# EasyEDA Pro project 【平衡车】STM32F103C8T6 .epro

# Schematic Schematic1
Create Date: 2022-09-10; Page Name: 【平衡车】STM32F103VCT6; Project Name: 【平衡车】STM32F103VCT6; Schematic Name: Schematic1; Update Date: 2023-07-14; Company: 嘉立创EDA
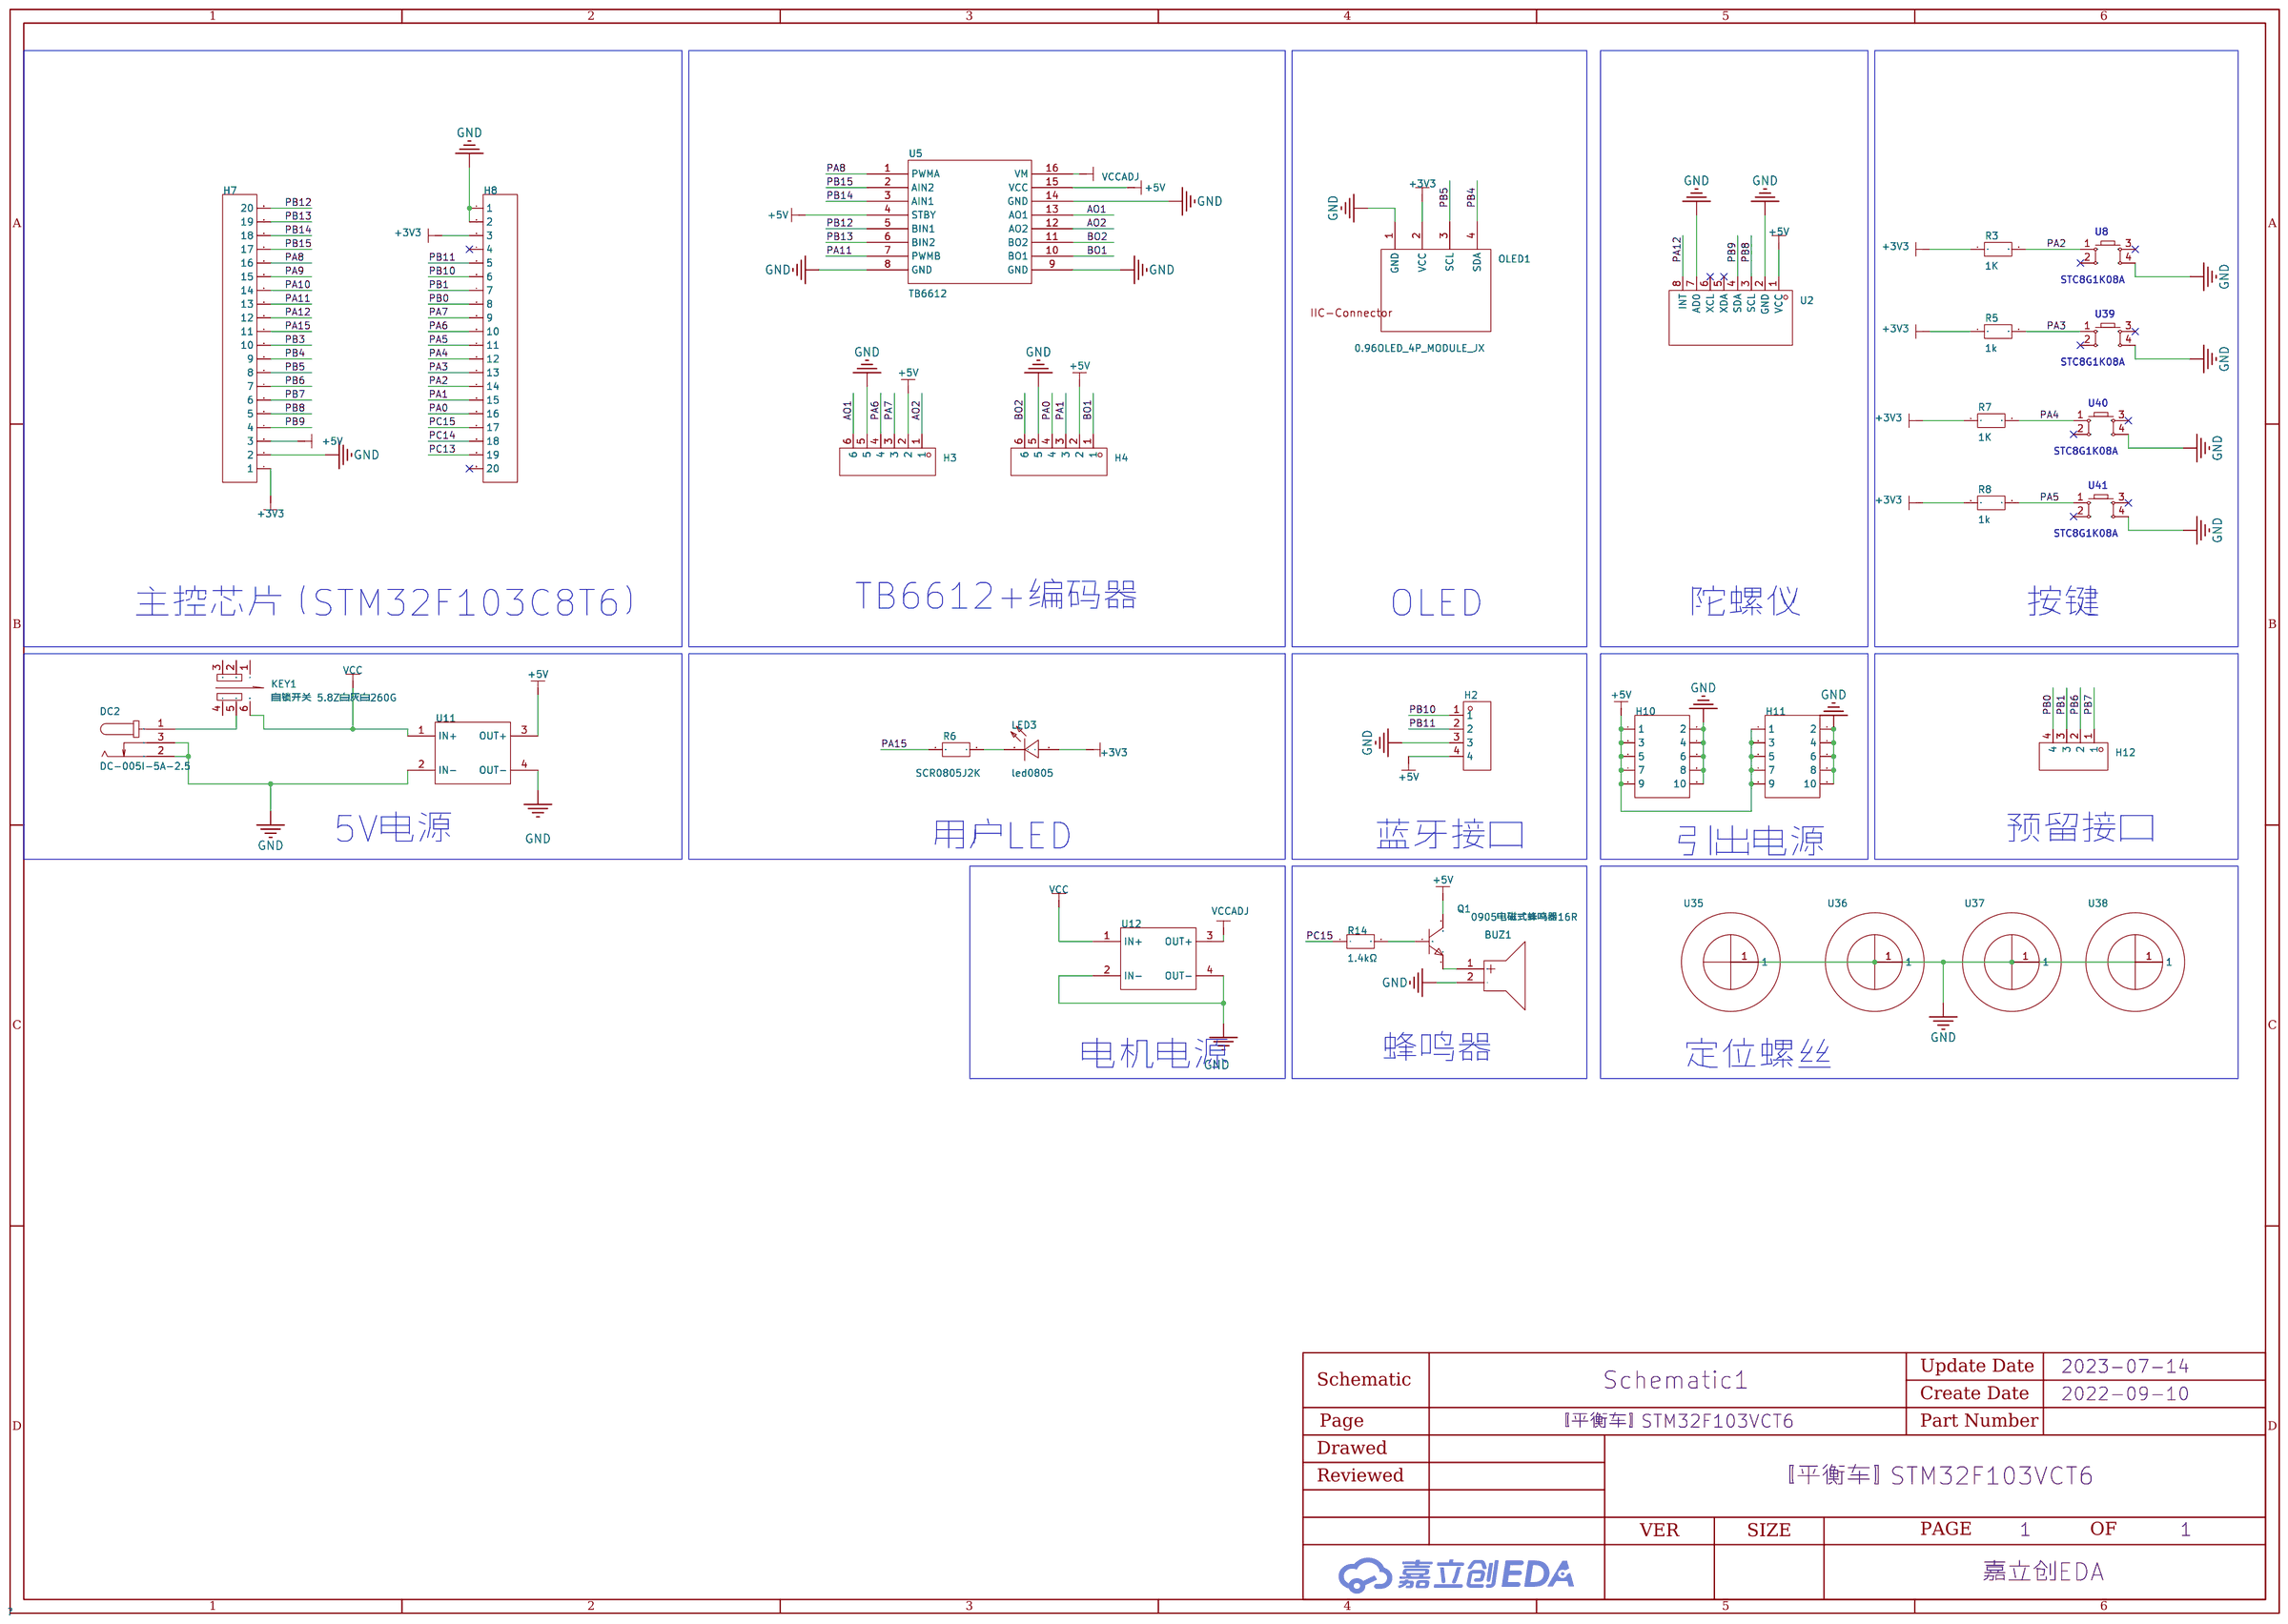
[diagram p0: schematic sheet]

## Parts
BUZ1  0905电磁式蜂鸣器16R  [BUZ-TH_BD9.0-P4.00-D0.6-FD]
DC2  DC-005I-5A-2.5  [DC-IN-TH_DC-005I-5A-2.5]
H2  -  [HDR-TH_4P-P2.54-V-F]
H3  -  [HDR-TH_6P-P2.54-V-F]
H4  -  [HDR-TH_6P-P2.54-V-F]
H7  -  [HDR-TH_20P-P2.54-V-F]
H8  -  [HDR-TH_20P-P2.54-V-F]
H10  -  [HDR-TH_10P-P2.54-V-F-R2-C5-S2.54]
H11  -  [HDR-TH_10P-P2.54-V-F-R2-C5-S2.54]
H12  -  [HDR-TH_4P-P2.54-V-F]
KEY1  自锁开关 5.8Z白灰白260G  [SW-TH_6P-L5.8-W5.8-P2.00-LS4.5-TR]
LED3  led0805  [LED0805-RD]
OLED1  0.96OLED_4P_MODULE_JX  [0.96OLED_4P]
Q1  -  [S8050_TO_92]
R3  1K  [R0805]
R5  1k  [R0805]
R6  SCR0805J2K  [R0805]
R7  1K  [R0805]
R8  1k  [R0805]
R14  1.4kΩ  [R0603]
U2  -  [MPU6050]
U5  TB6612  [TB6612]
U8  STC8G1K08A  [SW-TH_4P-L6.0-W6.0-P4.50-LS6.5]
U11  -  [LM2596模块]
U12  -  [LM2596模块]
U35  -  [M3_花孔]
U36  -  [M3_花孔]
U37  -  [M3_花孔]
U38  -  [M3_花孔]
U39  STC8G1K08A  [SW-TH_4P-L6.0-W6.0-P4.50-LS6.5]
U40  STC8G1K08A  [SW-TH_4P-L6.0-W6.0-P4.50-LS6.5]
U41  STC8G1K08A  [SW-TH_4P-L6.0-W6.0-P4.50-LS6.5]

## Library data of the parts
BUZ1 = 0905电磁式蜂鸣器16R: Supplier Part: C9900018545; Supplier Footprint: TH-2P; JLCPCB Part Class: 扩展库; Datasheet: https://atta.szlcsc.comnull; Supplier: LCSC
DC2 = DC-005I-5A-2.5: 连接器类型:DC电源插座;安装方式:弯插;触点内径:2.5mm;触点外径:5.85mm;额定电流:5A;额定电压:24V;触头材质:黄铜;工作温度范围:-20℃~+70℃;焊接温度(最大值):260℃;; LCSC Part Name: DC电源插座 内径:2.5mm 外径:5.85mm; Supplier Part: C2689704; Manufacturer: XKB Connectivity(中国星坤); Supplier Footprint: 插件; JLCPCB Part Class: 扩展库; Datasheet: https://atta.szlcsc.com/upload/public/pdf/source/20211011/5C01D7786A273E00B362418B0553C5C6.pdf; Supplier: LCSC; Connector Type: DC电源插座; Mounting Style: 弯插; Inside Contact Diameter: 2.5mm; Outside Contact Diameter: 5.85mm; Current Rating (Max): 5A; Voltage Rating (Max): 24V; Contact Material: 黄铜; Operating Temperature Range: -20℃~+70℃; Welding Temperature (Max): 260℃
H2 H12 = HDR-F_2.54_1x4P: Supplier Part: C2718488; Supplier Footprint: 插件
H3 H4 = HDR-F_2.54_1x6P: Supplier Part: C40877; Supplier Footprint: 插件
H7 H8 = HDR-F_2.54_1x20P: Supplier Part: C50984; Supplier Footprint: 插件
H10 H11 = HDR-F_2.54_2x5: Supplier Part: C92270; Supplier Footprint: 插件
KEY1 = 自锁开关 5.8Z白灰白260G: 耐温260度; LCSC Part Name: 自锁开关 5.8Z白灰白 260G  5.8*5.8mm; Supplier Part: C56857; Supplier Footprint: Through Hole; JLCPCB Part Class: 扩展库; Datasheet: https://atta.szlcsc.com/upload/public/pdf/source/20160318/1458266987096.pdf; Supplier: LCSC
LED3 = led0805: Supplier Part: C9900012722; JLCPCB Part Class: 扩展库; Datasheet: https://atta.szlcsc.comnull; Supplier: LCSC
OLED1 = 0.96OLED_4P_MODULE_JX: Supplier Part: C9900004566; Supplier Footprint: THrough hole; JLCPCB Part Class: 扩展库; Datasheet: https://atta.szlcsc.comnull; Supplier: LCSC
Q1 = S8050_TO_NPN: Supplier Footprint: TO-92
R3 R5-R8 = SCR0805J2K: LCSC Part Name: ±5% 2K; Supplier Part: C3017846; Manufacturer: VO(翔胜); Supplier Footprint: 0805; Datasheet: https://atta.szlcsc.com/upload/public/pdf/source/20220513/247AF9639BA21CF93567DC289CCC6A22.pdf; Supplier: LCSC
R14 = CRCW06031K40FKEA: 电阻类型:厚膜电阻;阻值:1.4kΩ;精度:±1%;功率:100mW;; LCSC Part Name: 1.4kΩ ±1% 100mW; Supplier Part: C844138; Manufacturer: VISHAY(威世); Supplier Footprint: 0603; JLCPCB Part Class: 扩展库; Datasheet: https://atta.szlcsc.com/upload/public/pdf/source/20200922/C242478_0C7172CD6F5C3D507069694ED76193BB.pdf; Supplier: LCSC; Type: 厚膜电阻; Tolerance: ±1%; Power(Watts): 100mW; Temperature Coefficient: ±100ppm/℃; Overload Voltage (Max): 75V; Operating Temperature Range: -55℃~+155℃
U2 = MPU6050: _: 3
U5 = TB6612
U8 U39-U41 = 轻触按键直插: Supplier Part: C9900022465; Supplier Footprint: SOP-8; JLCPCB Part Class: 扩展库; Datasheet: https://atta.szlcsc.comnull; Supplier: LCSC
U11 U12 = LM2596模块
U35-U38 = M3孔_花孔: Check: false

## Nets
+3V3: H7.1 H8.3 LED3.2(+) OLED1.2(VCC) R3.1 R5.1 R7.1 R8.1
+5V: H2.4 H3.2 H4.2 H7.3 H10.1 H10.3 H10.5 H10.7 H10.9 H11.1 H11.3 H11.5 H11.7 H11.9 Q1.3(C) U2.1(VCC) U5.4(STBY) U5.15(VCC) U11.3(OUT+)
GND: BUZ1.2(-) DC2.2 DC2.3 H2.3 H3.5 H4.5 H7.2 H8.1 H8.2 H10.2 H10.4 H10.6 H10.8 H10.10 H11.2 H11.4 H11.6 H11.8 H11.10 OLED1.1(GND) U2.2(GND) U2.7(AD0) U5.8(GND) U5.9(GND) U5.14(GND) U8.4 U11.2(IN-) U11.4(OUT-) U12.2(IN-) U12.4(OUT-) U35.1 U36.1 U37.1 U38.1 U39.4 U40.4 U41.4
VCC: KEY1.6 U11.1(IN+) U12.1(IN+)
VCCADJ: U5.16(VM) U12.3(OUT+)
AO1: H3.6 U5.13(AO1)
AO2: H3.1 U5.12(AO2)
BO1: H4.1 U5.10(BO1)
BO2: H4.6 U5.11(BO2)
PA0: H4.4 H8.16
PA1: H4.3 H8.15
PA2: H8.14 R3.2 U8.1
PA3: H8.13 R5.2 U39.1
PA4: H8.12 R7.2 U40.1
PA5: H8.11 R8.2 U41.1
PA6: H3.4 H8.10
PA7: H3.3 H8.9
PA8: H7.16 U5.1(PWMA)
PA9: H7.15
PA10: H7.14
PA11: H7.13 U5.7(PWMB)
PA12: H7.12 U2.8(INT)
PA15: H7.11 R6.1
PB0: H8.8 H12.4
PB1: H8.7 H12.3
PB3: H7.10
PB4: H7.9 OLED1.4(SDA)
PB5: H7.8 OLED1.3(SCL)
PB6: H7.7 H12.2
PB7: H7.6 H12.1
PB8: H7.5 U2.3(SCL)
PB9: H7.4 U2.4(SDA)
PB10: H2.1 H8.6
PB11: H2.2 H8.5
PB12: H7.20 U5.5(BIN1)
PB13: H7.19 U5.6(BIN2)
PB14: H7.18 U5.3(AIN1)
PB15: H7.17 U5.2(AIN2)
PC13: H8.19
PC14: H8.18
PC15: H8.17 R14.1
$1N43883: LED3.1(-) R6.2
$1N45632: DC2.1 KEY1.5
$1N46079: Q1.2(B) R14.2
$1N46080: BUZ1.1(+) Q1.1(E)

Not connected (* = marked no-connect by the designer): H8 4* 20*; KEY1 1 2 3 4; U2 5(XDA)* 6(XCL)*; U8 2* 3*; U39 2* 3*; U40 2* 3*; U41 2* 3*

## Notes on the sheet
- TB6612+编码器
- 主控芯片（STM32F103C8T6）
- OLED
- 陀螺仪
- 按键
- 5V电源
- 用户LED
- 蓝牙接口
- 引出电源
- 预留接口
- 蜂鸣器
- 电机电源
- 定位螺丝

# Board PCB1
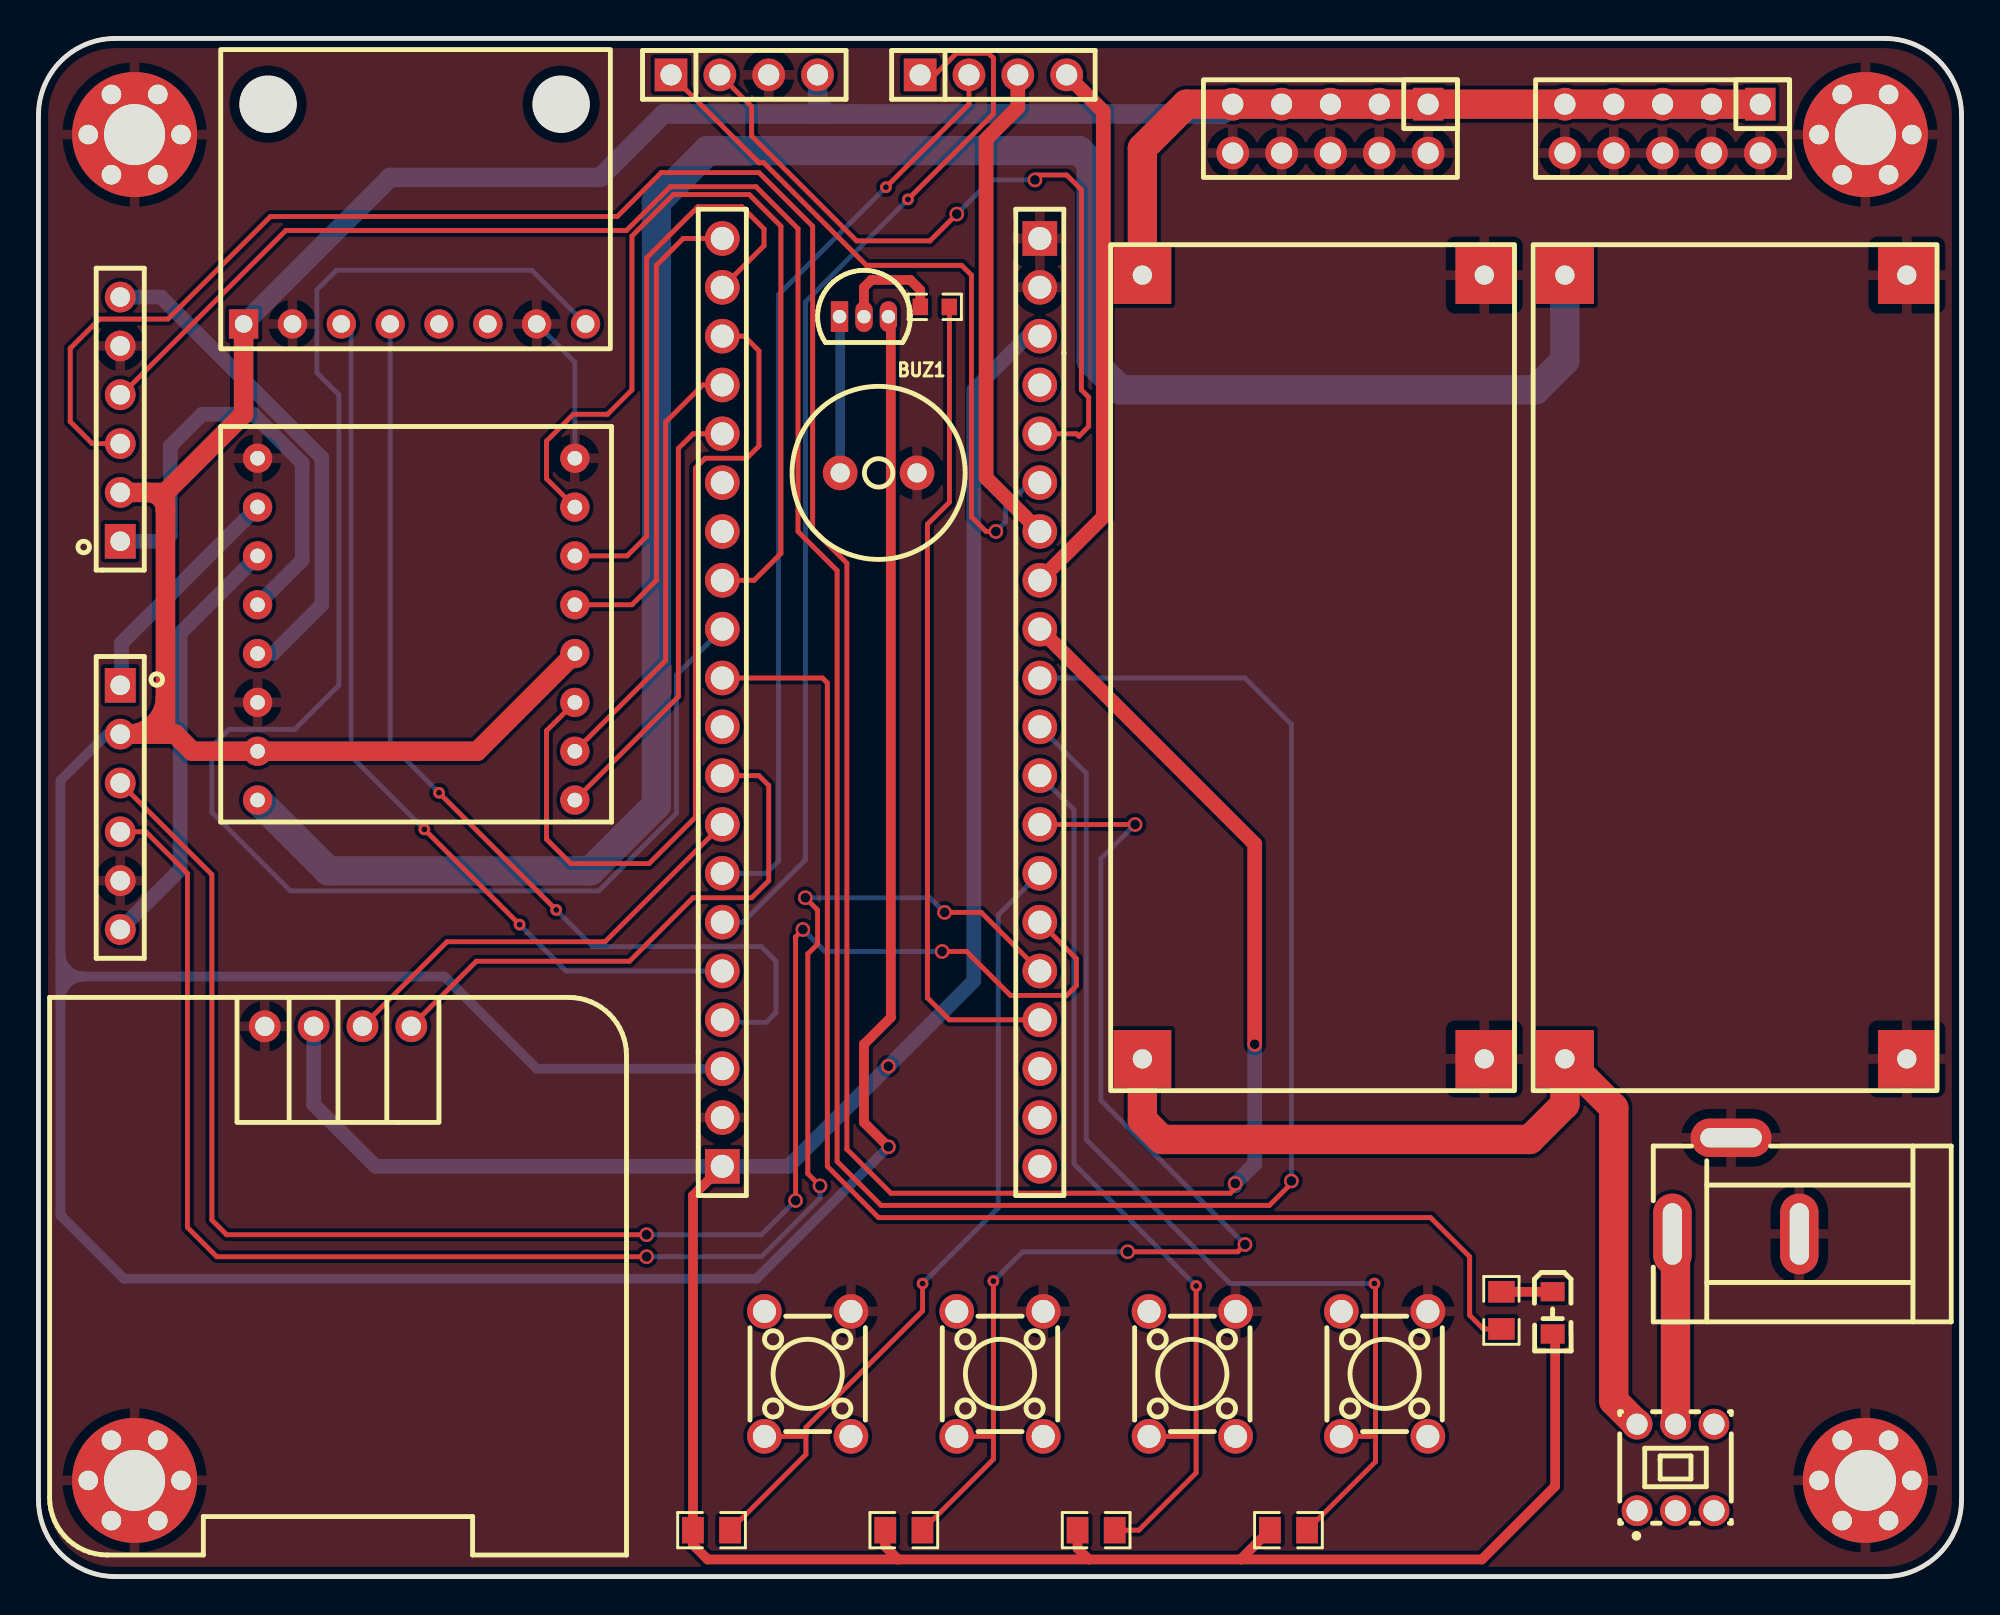
[diagram p1: board, top side]
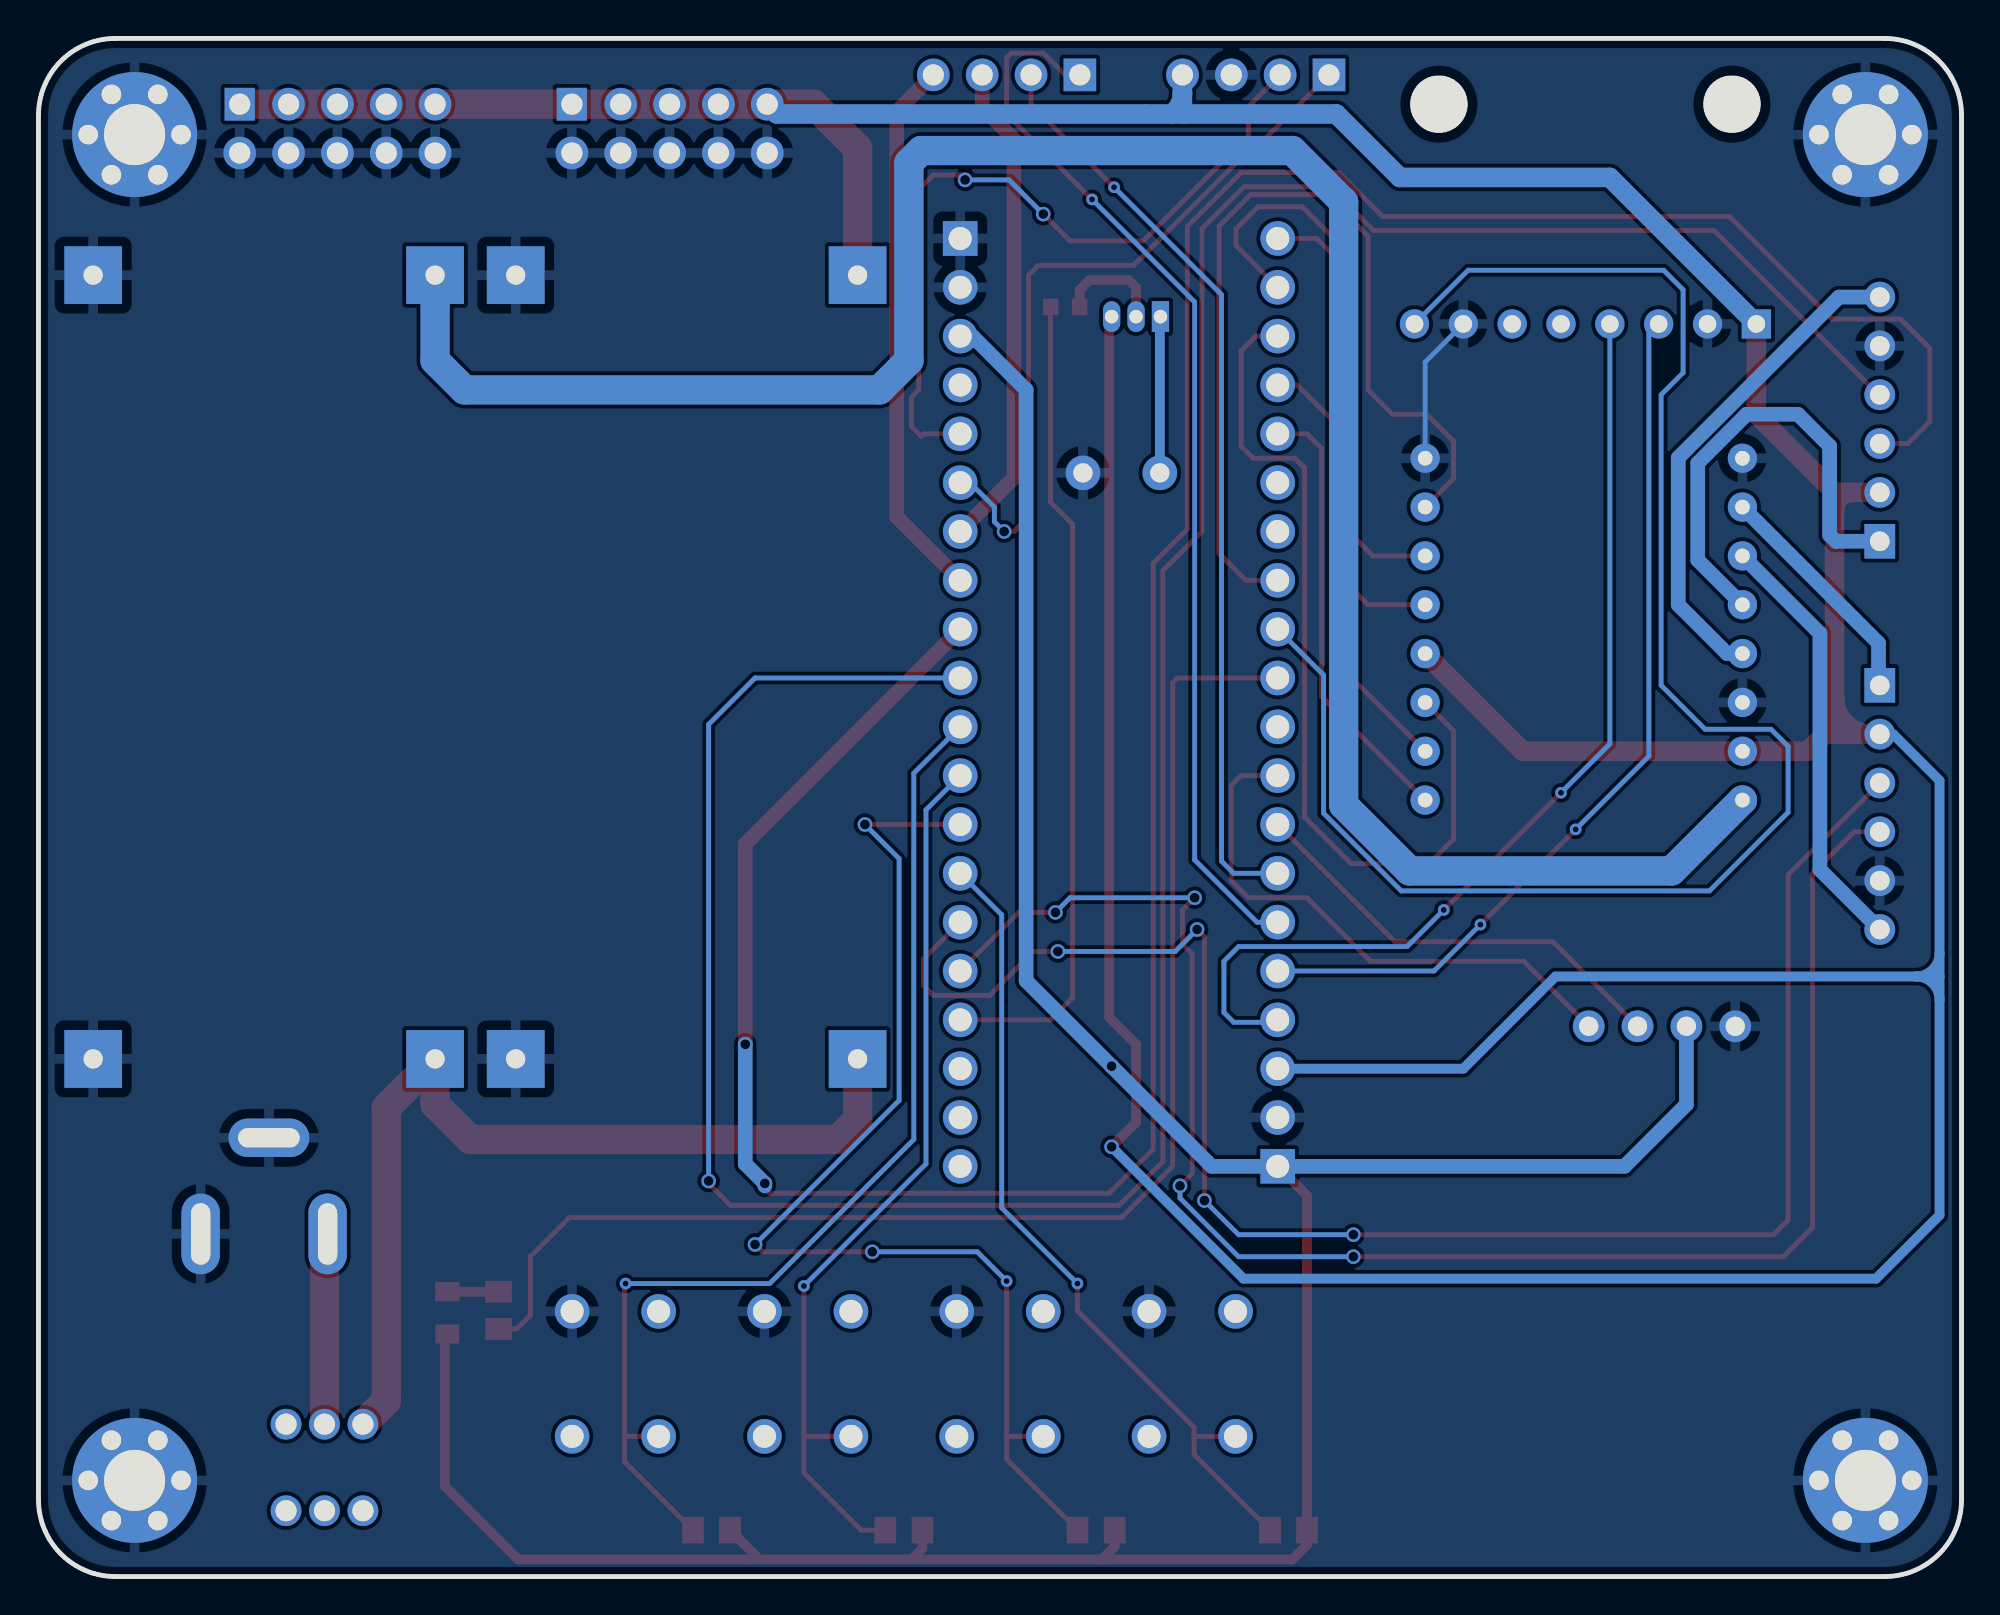
[diagram p2: board, bottom side, seen from below]

Outline 100 x 80 mm; copper layers: Top Layer, Bottom Layer. Coordinates in mm from the lower left corner of the outline.
Outline path: 0,76 0,4 arc(1.17,1.17) 4,0 96,0 arc(98.83,1.17) 100,4 100,76 arc(98.83,78.83) 96,80 4,80 arc(1.17,78.83) 0,76
Stack: Top Layer 0.035mm / Dielectric1 1.51mm FR4 er 4.5 / Bottom Layer 0.035mm

## Design rules (mm)
spacing safeClearance (default): track to track 0.152, other pairs 0.152 to 0.3
track width trackWidth (default): min 0.127, default 0.254, max 2.54
differential pair differentialPair (default): width min 0.127, default 0.254, max 2.54; gap min 0.152, default 0.152
via viaSize (default): diameter min 0.5, default 0.61, max 10; hole min 0.3, default 0.305, max 6

## Placement (name value [footprint] x y rotation side)
BUZ1  0905电磁式蜂鸣器16R  [BUZ-TH_BD9.0-P4.00-D0.6-FD]  43.69 57.4 0 top
DC2  DC-005I-5A-2.5  [DC-IN-TH_DC-005I-5A-2.5]  88.26 20.32 180 top
H2  -  [HDR-TH_4P-P2.54-V-F]  36.7 78.11 0 top
H3  -  [HDR-TH_6P-P2.54-V-F]  4.25 60.2 90 top
H4  -  [HDR-TH_6P-P2.54-V-F]  4.25 40 270 top
H7  -  [HDR-TH_20P-P2.54-V-F]  35.56 45.47 90 top
H8  -  [HDR-TH_20P-P2.54-V-F]  52.07 45.47 270 top
H10  -  [HDR-TH_10P-P2.54-V-F-R2-C5-S2.54]  67.18 75.31 180 top
H11  -  [HDR-TH_10P-P2.54-V-F-R2-C5-S2.54]  84.46 75.31 180 top
H12  -  [HDR-TH_4P-P2.54-V-F]  49.66 78.11 0 top
KEY1  自锁开关 5.8Z白灰白260G  [SW-TH_6P-L5.8-W5.8-P2.00-LS4.5-TR]  85.13 5.67 180 top
LED3  led0805  [LED0805-RD]  78.74 13.72 270 top
OLED1  0.96OLED_4P_MODULE_JX  [0.96OLED_4P]  15.58 28.62 0 top
Q1  -  [S8050_TO_92]  42.93 65.53 0 top
R3  1K  [R0805]  35 2.41 0 top
R5  1k  [R0805]  45 2.41 0 top
R6  SCR0805J2K  [R0805]  76.07 13.84 90 top
R7  1K  [R0805]  55 2.41 0 top
R8  1k  [R0805]  65 2.41 0 top
R14  1.4kΩ  [R0603]  46.61 66.04 180 top
U2  -  [MPU6050]  19.56 65.15 90 top
U5  -  [TB6612]  19.38 49.53 180 top
U8  STC8G1K08A  [SW-TH_4P-L6.0-W6.0-P4.50-LS6.5]  40 10.54 90 top
U11  -  [LM2596模块]  55.75 25.15 90 top
U12  -  [LM2596模块]  77.72 25.15 90 top
U35  -  [M3_花孔]  5 5 0 top
U36  -  [M3_花孔]  95 5 0 top
U37  -  [M3_花孔]  95 75 0 top
U38  -  [M3_花孔]  5 75 0 top
U39  STC8G1K08A  [SW-TH_4P-L6.0-W6.0-P4.50-LS6.5]  50 10.54 90 top
U40  STC8G1K08A  [SW-TH_4P-L6.0-W6.0-P4.50-LS6.5]  60 10.54 90 top
U41  STC8G1K08A  [SW-TH_4P-L6.0-W6.0-P4.50-LS6.5]  70 10.54 90 top

## Footprints (pads in the part's own frame, mm; a bottom-side part is the same pattern mirrored in y, then rotated)
0.96OLED_4P
  round 1.651 hole 1.001: 1(-3.81,0) 2(-1.27,0.003) 3(1.27,0.003) 4(3.81,0.003)
BUZ-TH_BD9.0-P4.00-D0.6-FD
  round 1.801 hole 1.001: 1(-1.999,0) 2(1.999,0)
DC-IN-TH_DC-005I-5A-2.5
  oval 2x4.2 hole 1x3.2: 1(3.3,2.5) 2(-3.3,2.5)
  oval 4.2x2 hole 3.2x1: 3(0.25,-2.5)
HDR-TH_4P-P2.54-V-F
  rect 1.7x1.7 hole 1.1: 1(-3.81,0)
  round 1.7 hole 1.1: 2(-1.27,0) 3(1.27,0) 4(3.81,0)
HDR-TH_6P-P2.54-V-F
  rect 1.8x1.6 hole 1.02: 1(-6.35,0)
  round 1.6 hole 1.02: 2(-3.81,0) 3(-1.27,0) 4(1.27,0) 5(3.81,0) 6(6.35,0)
HDR-TH_10P-P2.54-V-F-R2-C5-S2.54
  rect 1.575x1.7 hole 1.1: 1(-5.08,-1.27)
  round 1.7 hole 1.1: 2(-5.08,1.27) 3(-2.54,-1.27) 4(-2.54,1.27) 5(0,-1.27) 6(0,1.27) 7(2.54,-1.27) 8(2.54,1.27) 9(5.08,-1.27) 10(5.08,1.27)
HDR-TH_20P-P2.54-V-F
  rect 1.8x1.8 hole 1.2: 1(-24.13,0)
  round 1.8 hole 1.2: 2(-21.59,0) 3(-19.05,0) 4(-16.51,0) 5(-13.97,0) 6(-11.43,0) 7(-8.89,0) 8(-6.35,0) 9(-3.81,0) 10(-1.27,0) 11(1.27,0) 12(3.81,0) 13(6.35,0) 14(8.89,0) 15(11.43,0) 16(13.97,0) 17(16.51,0) 18(19.05,0) 19(21.59,0) 20(24.13,0)
LED0805-RD
  rect 1x1.25 smd: 1(-1.1,0) 2(1.1,0)
LM2596模块
  rect 3x3 hole 1: 1(1.778,-1.651) 2(1.778,-19.431) 3(42.545,-1.651) 4(42.545,-19.431)
M3_花孔
  round 1.016 hole 1.016: 1(-2.413,0) 1(-1.206,2.09) 1(-1.206,-2.09) 1(1.206,2.09) 1(1.206,-2.09) 1(2.413,0)
  round 6.5 hole 3.175: 1(0,0)
MPU6050
  rect 1.524x1.524 hole 0.914: 1(0,8.89)
  round 1.524 hole 0.914: 2(0,6.35) 3(0,3.81) 4(0,1.27) 5(0,-1.27) 6(0,-3.81) 7(0,-6.35) 8(0,-8.89)
R0603
  rect 0.806x0.864 smd: 1(-0.753,0) 2(0.753,0)
R0805
  rect 1.133x1.377 smd: 1(-0.966,0) 2(0.966,0)
S8050_TO_92
  rect 0.899x1.6 hole 0.701: 1(-1.27,0)
  oval 0.899x1.6 hole 0.701: 2(0,0) 3(1.27,0)
SW-TH_4P-L6.0-W6.0-P4.50-LS6.5
  round 1.8 hole 1.2: 1(-3.25,2.25) 2(3.25,2.25) 3(-3.25,-2.25) 4(3.25,-2.25)
SW-TH_6P-L5.8-W5.8-P2.00-LS4.5-TR
  round 1.6 hole 1.1: 1(2,2.25) 2(0,2.25) 3(-2,2.25) 4(-2,-2.25) 5(0,-2.25) 6(2,-2.25)
TB6612
  round 1.524 hole 0.762: 1(-8.509,9.144) 2(-8.509,6.604) 3(-8.509,4.064) 4(-8.509,1.524) 5(-8.509,-1.016) 6(-8.509,-3.556) 7(-8.509,-6.096) 8(-8.509,-8.636) 9(7.991,-8.636) 10(7.991,-6.096) 11(7.991,-3.556) 12(7.991,-1.016) 13(7.991,1.524) 14(7.991,4.064) 15(7.991,6.604) 16(7.991,9.144)

## Nets
As in the schematic.

Pads without a net: H8 4 20; KEY1 1 2 3 4; U2 5 6; U8 2 3; U39 2 3; U40 2 3; U41 2 3

## Via types
v1: diameter 0.762, hole 0.508, Top Layer to Bottom Layer, 19 vias
v2: diameter 0.61, hole 0.305, Top Layer to Bottom Layer, 10 vias

## Routing (per net, layer and track width the routed paths; a pad name or vN(x,y) marks a point on that pad's centre or on a via; arc(x,y) is an arc through that point)
+3V3: length 159.8
  Top Layer w0.508: 62.51,0.89 75.06,0.89 78.87,4.7 78.87,12.49 LED3.2 ; 62.51,0.89 R8.1 ; 62.51,0.89 54.61,0.89 ; 44.7,0.89 34.8,0.89 34.03,1.65 R3.1 34.04,2.41 34.04,19.81 H7.1 ; 44.7,0.89 44.03,1.56 R5.1 ; 44.7,0.89 54.61,0.89 ; 54.61,0.89 54.03,1.47 R7.1
  Bottom Layer w0.762: H8.3 51.44,64.52 48.64,61.72 48.64,30.99 v1(44.2,26.54) 38.99,21.34 H7.1 17.53,21.34 14.31,24.55 OLED1.2
+5V: length 313.7
  Top Layer w0.508: Q1.3 44.32,65.41 44.32,29.08 42.93,27.69 42.93,23.62 v1(44.2,22.35)
  Top Layer w1.016: 6.5,43.81 6.6,43.91 6.6,45.75 ; 6.5,43.81 4.67,43.81 ; 6.5,43.81 7.11,43.81 8,42.93 U5.15 22.81,42.93 U5.4 ; 4.67,43.81 H4.2 ; 4.67,43.81 arc(6.04,44.38) 6.6,45.75 ; 6.6,56.39 6.6,55.45 ; 6.6,56.39 10.67,60.45 U2.1 ; 6.6,56.39 5.67,56.39 ; 6.6,55.45 6.6,45.75 ; 6.6,55.45 arc(6.33,56.11) 5.67,56.39 ; 5.67,56.39 H3.2
  Top Layer w1.524: H11.1 H11.3 H11.5 H11.7 H11.9 H10.1 H10.5 H10.7 59.69,76.58 57.4,74.3 U11.3
  Bottom Layer w0.508: 1.14,32.44 1.14,31.21 ; 1.14,32.44 1.14,41.4 3.56,43.81 H4.2 ; 1.14,32.44 arc(1.5,31.57) 2.37,31.21 ; 1.14,31.21 2.37,31.21 ; 1.14,31.21 1.14,29.98 ; 2.37,31.21 21.11,31.21 25.91,26.42 H7.3 ; 2.37,31.21 arc(1.5,30.85) 1.14,29.98 ; 1.14,29.98 1.14,18.8 4.44,15.49 37.34,15.49 v1(44.2,22.35)
  Bottom Layer w1.016: 62.1,76.58 61.59,76.07 42.54,76.07 ; 40.4,76.07 32.51,76.07 29.21,72.77 18.29,72.77 U2.1 ; 40.4,76.07 41.04,76.07 ; 40.4,76.07 40.51,76.18 40.51,77.16 ; H2.4 40.51,77.16 ; 40.51,77.16 arc(40.62,76.64) 40.91,76.21 41.04,76.07 ; 41.04,76.07 42.42,76.07
GND: length 7.8
  Bottom Layer w0.254: U5.8 27.89,63.17 U2.7
VCC: length 49.2
  Top Layer w1.524: KEY1.6 81.91,9.14 81.91,24.38 U12.1 79.38,24.56 77.55,22.73 58.42,22.73 57.4,23.75 U11.1
VCCADJ: length 119.7
  Bottom Layer w1.524: U5.16 15.08,36.7 28.7,36.7 32.13,40.13 32.13,71.5 34.8,74.17 54.1,74.17 54.74,73.53 54.74,63.25 56.26,61.72 77.85,61.72 79.38,63.25 U12.3
AO1: length 26
  Bottom Layer w0.762: H3.6 6.37,66.55 14.73,58.19 14.73,50.55 12.19,48.01 U5.13
AO2: length 24.3
  Bottom Layer w0.762: H3.1 6.54,53.85 6.86,54.17 6.86,58.8 8.51,60.45 11.18,60.45 13.72,57.91 13.72,52.87 U5.12
BO1: length 12.2
  Bottom Layer w0.762: 4.25,46.36 4.32,46.42 4.32,48.55 U5.10
BO2: length 22.4
  Bottom Layer w0.762: U5.11 7.37,49.06 7.37,36.77 H4.6
PA0: length 87.7
  Top Layer w0.254: H4.4 5.59,38.73 7.75,36.58 7.75,18.16 9.27,16.64 v1(31.62,16.64) ; v1(39.88,35.31) 40.51,34.67 40.51,32.89 40,32.39 40,20.96 v1(40.64,20.32) ; H8.16 49.02,34.54 v1(47.12,34.54)
  Bottom Layer w0.254: v1(47.12,34.54) 46.35,35.31 v1(39.88,35.31) ; v1(31.62,16.64) 37.59,16.64 40.64,19.69 v1(40.64,20.32)
PA1: length 90.3
  Top Layer w0.254: H8.15 53.97,32.13 53.97,30.73 53.47,30.23 50.55,30.23 48.26,32.51 v1(46.99,32.51) ; v1(39.37,19.56) 39.37,33.27 v1(39.75,33.66) ; v1(31.62,17.78) 9.78,17.78 9.02,18.54 9.02,36.51 4.25,41.28
  Bottom Layer w0.254: v1(39.37,19.56) 37.59,17.78 v1(31.62,17.78) ; v1(46.99,32.51) 40.89,32.51 v1(39.75,33.66)
PA2: length 43
  Top Layer w0.254: R3.2 39.91,6.36 39.91,7.35 ; v2(45.97,15.24) 45.97,13.82 39.91,7.75 39.91,7.35 ; 39.91,7.35 39.85,7.29 U8.1
  Bottom Layer w0.254: H8.14 49.91,34.42 49.91,19.18 v2(45.97,15.24)
PA3: length 60.9
  Top Layer w0.254: v1(57.02,39.12) H8.13 ; v2(49.66,15.37) 49.66,15.37 49.66,7.35 ; v1(62.74,17.27) 62.36,16.89 v1(56.64,16.89) ; 49.66,7.35 49.6,7.29 U39.1 ; 49.66,7.35 49.66,6.1 R5.2
  Bottom Layer w0.254: v1(57.02,39.12) 55.25,37.34 55.25,24.77 v1(62.74,17.27) ; v1(56.64,16.89) 51.18,16.89 v2(49.66,15.37)
PA4: length 47.6
  Top Layer w0.254: R7.2 57.22,2.41 60.2,5.39 60.2,7.38 ; 60.2,7.38 v2(60.2,15.11) ; 60.2,7.38 60.11,7.29 U40.1
  Bottom Layer w0.254: v2(60.2,15.11) 53.85,21.46 53.85,39.88 H8.12
PA5: length 56.7
  Top Layer w0.254: v2(69.47,15.24) 69.53,15.18 69.53,7.28 ; 69.53,7.28 69.53,5.97 R8.2 ; 69.53,7.28 69.51,7.29 U41.1
  Bottom Layer w0.254: v2(69.47,15.24) 61.98,15.24 54.48,22.73 54.48,41.78 H8.11
PA6: length 153
  Top Layer w0.254: H3.4 4.32,61.47 12.86,70.01 30.57,70.01 32.85,72.29 37.31,72.29 39.5,70.1 39.5,54.36 41.53,52.32 41.53,21.59 43.81,19.3 64.01,19.3 65.15,20.45 v1(65.15,20.57)
  Bottom Layer w0.254: H8.10 62.74,46.74 65.15,44.32 v1(65.15,20.57)
PA7: length 154.6
  Top Layer w0.254: H3.3 2.79,58.93 1.65,60.07 1.65,63.88 3.17,65.41 6.73,65.41 12.06,70.74 30.1,70.74 32.38,73.03 37.47,73.03 40.26,70.23 40.26,54.48 42.04,52.7 42.04,22.22 44.32,19.94 61.98,19.94 62.36,20.32
  Top Layer w0.762: H8.9 63.25,38.1 v1(63.25,27.69)
  Bottom Layer w0.762: 62.23,20.32 v1(62.23,20.45) 63.25,21.46 v1(63.25,27.69)
PA8: length 23.1
  Top Layer w0.254: U5.1 33.27,45.77 33.27,58.67 34.04,59.44 H7.16
PA11: length 47.6
  Top Layer w0.254: U5.7 26.42,57.1 26.42,59.06 27.81,60.45 29.59,60.45 30.86,61.72 30.86,69.72 33.02,71.88 36.96,71.88 38.61,70.23 38.61,53.21 37.21,51.82 H7.13
PA12: length 86
  Bottom Layer w0.254: U2.8 25.65,67.94 15.49,67.94 14.48,66.93 14.48,62.61 15.62,61.47 15.62,46.36 13.33,44.07 9.91,44.07 9.02,43.18 9.02,39.75 13.11,35.66 29.13,35.66 33.17,39.7 33.17,46.89 H7.12
PA15: length 71.1
  Top Layer w0.254: R6.1 75.13,12.88 74.42,13.59 74.42,16.64 72.39,18.67 43.69,18.67 41.02,21.34 41.02,46.48 40.77,46.74 H7.11
PB0: length 28.4
  Top Layer w0.762: H12.4 55.37,76.2 55.37,55.12 H8.8
PB1: length 25.6
  Top Layer w0.762: H12.3 50.93,76.41 49.28,74.76 49.28,57.15 H8.7
PB4: length 29.3
  Top Layer w0.254: OLED1.4 22.77,32 30.73,32 34.04,35.31 37.08,35.31 37.97,36.19 37.97,41.15 37.47,41.66 H7.9
PB5: length 23.1
  Top Layer w0.254: OLED1.3 21.25,33.02 29.46,33.02 H7.8
PB6: length 48.2
  Top Layer w0.254: H12.2 48.39,76.58 v2(44.07,72.26)
  Bottom Layer w0.254: H7.7 37.85,36.58 38.48,37.21 38.48,66.67 v2(44.07,72.26)
PB7: length 55.8
  Top Layer w0.254: H12.1 46.61,78.11 47.74,79.23 49.4,79.23 49.66,78.98 49.66,76.07 v2(45.21,71.63)
  Bottom Layer w0.254: H7.6 36.64,34.04 39.88,37.28 39.88,66.29 v2(45.21,71.63)
PB8: length 46.6
  Top Layer w0.254: v2(25.02,33.91) v2(20.07,38.86)
  Bottom Layer w0.254: H7.5 27.43,31.5 v2(25.02,33.91) ; v2(20.07,38.86) 16.26,42.67 16.26,64.64 U2.3
PB9: length 52.3
  Top Layer w0.254: v2(20.83,40.77) v2(26.92,34.67)
  Bottom Layer w0.254: v2(20.83,40.77) 18.29,43.31 U2.4 ; v2(26.92,34.67) 28.83,32.77 37.59,32.77 38.35,32 38.35,29.34 37.85,28.83 35.69,28.83 H7.4
PB10: length 37.9
  Top Layer w0.254: v1(49.78,54.36) 49.28,54.36 48.51,55.12 48.51,67.69 48.01,68.2 43.05,68.2 37.72,73.53 37.47,73.53 H2.1
  Bottom Layer w0.254: v1(49.78,54.36) 50.29,54.86 50.29,55.63 51.56,56.9 H8.6
PB11: length 40.5
  Top Layer w0.254: v1(51.82,72.64) 51.69,72.64 51.94,72.9 53.47,72.9 54.23,72.14 54.23,61.72 54.61,61.34 54.61,59.82 54.1,59.31 53.97,59.44 H8.5 ; v1(47.75,70.87) 46.35,69.47 42.54,69.47 37.08,74.93 37.08,76.45 H2.2
  Bottom Layer w0.254: v1(51.82,72.64) 49.53,72.64 v1(47.75,70.87)
PB12: length 25.2
  Top Layer w0.254: U5.5 30.86,50.55 32.13,51.82 32.13,68.2 33.53,69.6 H7.20
PB13: length 30.3
  Top Layer w0.254: U5.6 30.61,53.09 31.62,54.1 31.62,68.58 34.29,71.25 36.58,71.25 37.73,70.09 37.73,69.23 H7.19
PB14: length 46.1
  Top Layer w0.254: U5.3 26.42,43.99 26.42,38.35 27.69,37.08 31.75,37.08 34.16,39.5 34.16,57.66 34.67,58.17 36.83,58.17 37.47,58.8 37.47,63.75 36.7,64.52 H7.18
PB15: length 22.8
  Top Layer w0.254: H7.17 34.54,61.98 32.61,60.05 32.61,47.65 U5.2
PC15: length 42.3
  Top Layer w0.254: H8.17 47.37,28.96 46.23,30.1 46.23,54.74 47.37,55.88 47.37,65.65
$1N43883: length 2.7
  Top Layer w0.508: LED3.1 78.73,14.81 R6.2
$1N45632: length 10
  Top Layer w1.524: KEY1.5 85.13,17.66 DC2.1
$1N46079: length 5.7
  Top Layer w0.508: R14.2 45.86,66.92 45.34,67.44 43.31,67.44 42.93,67.06 Q1.2
$1N46080: length 8.1
  Bottom Layer w0.508: BUZ1.1 41.69,65.5 Q1.1

## Copper pours and planes (outline as drawn; the poured copper is in the pictures)
GND on Top Layer: 0.03,80.64 100.2,80.64 100.2,0 0.03,0
GND on Bottom Layer: 0,80.64 100.2,80.64 100.2,0 0,0
